# EAGLE design CMC_ECG (EAGLE 9.4.2)
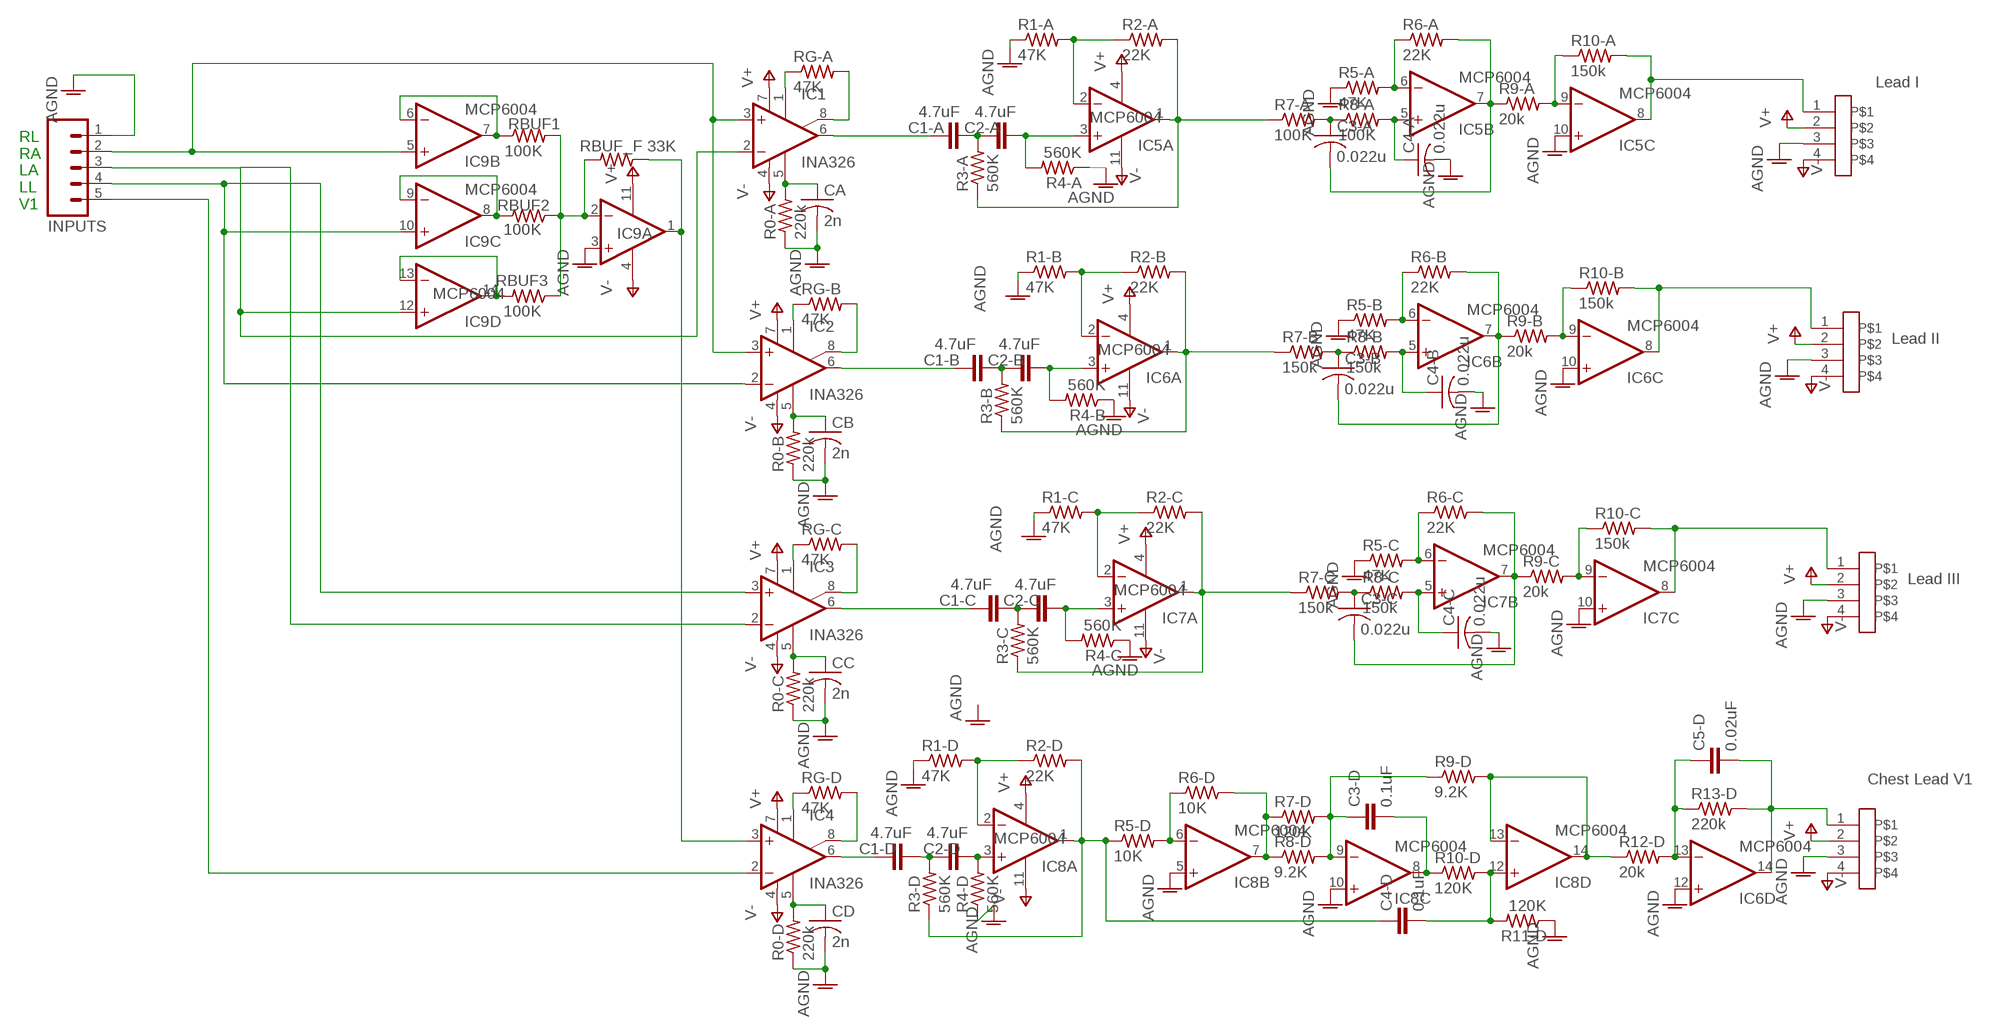
[diagram p0: schematic, sheet 1]

## Parts
C1-A  4.7uF  C-EUC0805  [C0805]
C1-B  4.7uF  C-EUC0805  [C0805]
C1-C  4.7uF  C-EUC0805  [C0805]
C1-D  4.7uF  C-EUC0805  [C0805]
C2-A  4.7uF  C-EUC0805  [C0805]
C2-B  4.7uF  C-EUC0805  [C0805]
C2-C  4.7uF  C-EUC0805  [C0805]
C2-D  4.7uF  C-EUC0805  [C0805]
C3-A  0.022u  C-USC0805  [C0805]
C3-B  0.022u  C-USC0805  [C0805]
C3-C  0.022u  C-USC0805  [C0805]
C3-D  0.1uF  C-EUC0805  [C0805]
C4-A  0.022u  C-USC0805  [C0805]
C4-B  0.022u  C-USC0805  [C0805]
C4-C  0.022u  C-USC0805  [C0805]
C4-D  0.1uF  C-EUC0805  [C0805]
C5-D  0.02uF  C-EUC0805  [C0805]
CA  2n  C-USC0805  [C0805]
CB  2n  C-USC0805  [C0805]
CC  2n  C-USC0805  [C0805]
CD  2n  C-USC0805  [C0805]
CHEST-V3  CON-4PIN_SIL  [CON-4PIN-SIL]
IC1  INA326  [MSOP-08]
IC2  INA326  [MSOP-08]
IC3  INA326  [MSOP-08]
IC4  INA326  [MSOP-08]
IC5  MCP6004  MCP604ST  [TSSOP14]
IC6  MCP6004  MCP604ST  [TSSOP14]
IC7  MCP6004  MCP604ST  [TSSOP14]
IC8  MCP6004  MCP604ST  [TSSOP14]
IC9  MCP6004  MCP604ST  [TSSOP14]
INPUTS  M05  [05P]
LEAD-I  CON-4PIN_SIL  [CON-4PIN-SIL]
LEAD-II  CON-4PIN_SIL  [CON-4PIN-SIL]
LEAD-II1  CON-4PIN_SIL  [CON-4PIN-SIL]
R0-A  220k  R-US_R0805  [R0805]
R0-B  220k  R-US_R0805  [R0805]
R0-C  220k  R-US_R0805  [R0805]
R0-D  220k  R-US_R0805  [R0805]
R1-A  47K  R-US_R0805  [R0805]
R1-B  47K  R-US_R0805  [R0805]
R1-C  47K  R-US_R0805  [R0805]
R1-D  47K  R-US_R0805  [R0805]
R2-A  22K  R-US_R0805  [R0805]
R2-B  22K  R-US_R0805  [R0805]
R2-C  22K  R-US_R0805  [R0805]
R2-D  22K  R-US_R0805  [R0805]
R3-A  560K  R-US_R0805  [R0805]
R3-B  560K  R-US_R0805  [R0805]
R3-C  560K  R-US_R0805  [R0805]
R3-D  560K  R-US_R0805  [R0805]
R4-A  560K  R-US_R0805  [R0805]
R4-B  560K  R-US_R0805  [R0805]
R4-C  560K  R-US_R0805  [R0805]
R4-D  560K  R-US_R0805  [R0805]
R5-A  47K  R-US_R0805  [R0805]
R5-B  47K  R-US_R0805  [R0805]
R5-C  47K  R-US_R0805  [R0805]
R5-D  10K  R-US_R0805  [R0805]
R6-A  22K  R-US_R0805  [R0805]
R6-B  22K  R-US_R0805  [R0805]
R6-C  22K  R-US_R0805  [R0805]
R6-D  10K  R-US_R0805  [R0805]
R7-A  100K  R-US_R0805  [R0805]
R7-B  150k  R-US_R0805  [R0805]
R7-C  150k  R-US_R0805  [R0805]
R7-D  120K  R-US_R0805  [R0805]
R8-A  100K  R-US_R0805  [R0805]
R8-B  150k  R-US_R0805  [R0805]
R8-C  150k  R-US_R0805  [R0805]
R8-D  9.2K  R-US_R0805  [R0805]
R9-A  20k  R-US_R0805  [R0805]
R9-B  20k  R-US_R0805  [R0805]
R9-C  20k  R-US_R0805  [R0805]
R9-D  9.2K  R-US_R0805  [R0805]
R10-A  150k  R-US_R0805  [R0805]
R10-B  150k  R-US_R0805  [R0805]
R10-C  150k  R-US_R0805  [R0805]
R10-D  120K  R-US_R0805  [R0805]
R11-D  120K  R-US_R0805  [R0805]
R12-D  20k  R-US_R0805  [R0805]
R13-D  220k  R-US_R0805  [R0805]
RBUF1  100K  R-US_R0805  [R0805]
RBUF2  100K  R-US_R0805  [R0805]
RBUF3  100K  R-US_R0805  [R0805]
RBUF_F  33K  R-US_R0805  [R0805]
RG-A  47K  R-US_R0805  [R0805]
RG-B  47K  R-US_R0805  [R0805]
RG-C  47K  R-US_R0805  [R0805]
RG-D  47K  R-US_R0805  [R0805]

## Nets
AGND: C4-A.2 C4-B.2 C4-C.2 CA.2 CB.2 CC.2 CD.2 CHEST-V3.3 IC5.10(C:+IN) IC6.10(C:+IN) IC6.12(D:+IN) IC7.10(C:+IN) IC8.5(B:+IN) IC8.10(C:+IN) IC9.3(A:+IN) INPUTS.1 LEAD-I.3 LEAD-II1.3 LEAD-II.3 R0-A.1 R0-B.1 R0-C.1 R0-D.1 R1-A.1 R1-B.1 R1-C.1 R1-D.1 R4-A.1 R4-B.1 R4-C.1 R4-D.1 R5-A.1 R5-B.1 R5-C.1 R11-D.1
HPF-OUT: IC5.1(A:OUT) R2-A.2 R3-A.1 R7-A.1
HPF-OUT1: IC6.1(A:OUT) R2-B.2 R3-B.1 R7-B.1
HPF-OUT2: IC7.1(A:OUT) R2-C.2 R3-C.1 R7-C.1
HPF-OUT3: C4-D.1 IC8.1(A:OUT) R2-D.2 R3-D.1 R5-D.1
INA-OUT: C1-A.1 IC1.6(OUT)
INA-OUT1: C1-B.1 IC2.6(OUT)
INA-OUT2: C1-C.1 IC3.6(OUT)
N$1: IC1.8(R1B) RG-A.2
N$2: CA.1 IC1.5(R2) R0-A.2
N$3: C4-A.1 IC5.5(B:+IN) R8-A.2
N$4: IC1.1(R1) RG-A.1
N$5: C3-A.1 R7-A.2 R8-A.1
N$6: C3-A.2 IC5.7(B:OUT) R6-A.2 R9-A.1
N$7: CD.1 IC4.5(R2) R0-D.2
N$8: CB.1 IC2.5(R2) R0-B.2
N$9: IC5.6(B:-IN) R5-A.2 R6-A.1
N$10: IC2.1(R1) RG-B.1
N$11: C1-A.2 C2-A.1 R3-A.2
N$12: C2-A.2 IC5.3(A:+IN) R4-A.2
N$13: IC5.2(A:-IN) R1-A.2 R2-A.1
N$14: C1-B.2 C2-B.1 R3-B.2
N$15: C2-B.2 IC6.3(A:+IN) R4-B.2
N$16: IC6.2(A:-IN) R1-B.2 R2-B.1
N$17: IC2.8(R1B) RG-B.2
N$18: C3-B.1 R7-B.2 R8-B.1
N$19: C3-B.2 IC6.7(B:OUT) R6-B.2 R9-B.1
N$20: IC6.6(B:-IN) R5-B.2 R6-B.1
N$21: C4-B.1 IC6.5(B:+IN) R8-B.2
N$22: IC1.2(-IN) IC3.2(-IN) IC9.12(D:+IN) INPUTS.3
N$23: CC.1 IC3.5(R2) R0-C.2
N$24: IC3.1(R1) RG-C.1
N$25: C1-C.2 C2-C.1 R3-C.2
N$26: C2-C.2 IC7.3(A:+IN) R4-C.2
N$27: IC7.2(A:-IN) R1-C.2 R2-C.1
N$28: IC3.8(R1B) RG-C.2
N$29: C3-C.1 R7-C.2 R8-C.1
N$30: C3-C.2 IC7.7(B:OUT) R6-C.2 R9-C.1
N$31: IC7.6(B:-IN) R5-C.2 R6-C.1
N$32: C4-C.1 IC7.5(B:+IN) R8-C.2
N$33: IC4.2(-IN) INPUTS.5
N$34: IC7.9(C:-IN) R9-C.2 R10-C.1
N$35: C1-D.2 C2-D.1 R3-D.2
N$36: IC7.8(C:OUT) LEAD-II1.1 R10-C.2
N$37: IC9.6(B:-IN) IC9.7(B:OUT) RBUF1.1
N$38: IC9.8(C:OUT) IC9.9(C:-IN) RBUF2.2
N$39: IC9.13(D:-IN) IC9.14(D:OUT) RBUF3.2
N$40: IC9.2(A:-IN) RBUF1.2 RBUF2.1 RBUF3.1 RBUF_F.2
N$41: C2-D.2 IC8.3(A:+IN) R4-D.2
N$42: IC2.2(-IN) IC3.3(+IN) IC9.10(C:+IN) INPUTS.4
N$43: IC4.1(R1) RG-D.1
N$44: IC4.8(R1B) RG-D.2
N$46: IC8.2(A:-IN) R1-D.2 R2-D.1
N$47: IC8.6(B:-IN) R5-D.2 R6-D.1
N$48: C1-D.1 IC4.6(OUT)
N$49: IC8.7(B:OUT) R6-D.2 R7-D.1 R8-D.1
N$50: C3-D.1 IC8.9(C:-IN) R7-D.2 R8-D.2 R9-D.1
N$51: C3-D.2 IC8.8(C:OUT) R10-D.1
N$52: C4-D.2 IC8.12(D:+IN) R10-D.2 R11-D.2
N$53: IC8.13(D:-IN) IC8.14(D:OUT) R9-D.2 R12-D.1
N$55: IC5.9(C:-IN) R9-A.2 R10-A.1
N$56: IC6.9(C:-IN) R9-B.2 R10-B.1
N$58: C5-D.1 IC6.13(D:-IN) R12-D.2 R13-D.1
N$59: C5-D.2 CHEST-V3.1 IC6.14(D:OUT) R13-D.2
N$61: IC6.8(C:OUT) LEAD-II.1 R10-B.2
N$62: IC5.8(C:OUT) LEAD-I.1 R10-A.2
V+: CHEST-V3.2 IC1.7(+VS) IC2.7(+VS) IC3.7(+VS) IC4.7(+VS) IC5.4(P:V+) IC6.4(P:V+) IC7.4(P:V+) IC8.4(P:V+) IC9.11(P:V-) LEAD-I.2 LEAD-II1.2 LEAD-II.2
V-: CHEST-V3.4 IC1.4(-VS) IC2.4(-VS) IC3.4(-VS) IC4.4(-VS) IC5.11(P:V-) IC6.11(P:V-) IC7.11(P:V-) IC8.11(P:V-) IC9.4(P:V+) LEAD-I.4 LEAD-II1.4 LEAD-II.4
VIN+: IC1.3(+IN) IC2.3(+IN) IC9.5(B:+IN) INPUTS.2
VIN+1: IC4.3(+IN) IC9.1(A:OUT) RBUF_F.1
Unconnected: IC5.12(D:+IN) IC5.13(D:-IN) IC5.14(D:OUT) IC7.12(D:+IN) IC7.13(D:-IN) IC7.14(D:OUT)

## Notes on the sheet
- Lead I
- RL
  RA
  LA
  LL
  V1
- Lead II
- Lead III
- Chest Lead V1

## Library data of the parts
C1-A C1-B C1-C C1-D C2-A C2-B C2-C C2-D C3-D C4-D C5-D = rcl:C-EU: CAPACITOR, European symbol
C3-A C3-B C3-C C4-A C4-B C4-C CA CB CC CD = rcl:C-US: CAPACITOR, American symbol
CHEST-V3 LEAD-I LEAD-II LEAD-II1 = surdev:CON-4PIN_SIL
IC1-IC4 = burr-brown_updated:INA326
IC5-IC9 = linear:MCP604: Quad Op Amp 2.7V to 6.0V Single Supply CMOS Source: http://ww1.microchip.com/downloads/en/DeviceDoc/21314g.pdf
INPUTS = con-amp-quick:M05: AMP QUICK CONNECTOR; OC_FARNELL: unknown; OC_NEWARK: unknown
R0-A R0-B R0-C R0-D R1-A R1-B R1-C R1-D R2-A R2-B R2-C R2-D R3-A R3-B R3-C R3-D R4-A R4-B R4-C R4-D R5-A R5-B R5-C R5-D R6-A R6-B R6-C R6-D R7-A R7-B R7-C R7-D R8-A R8-B R8-C R8-D R9-A R9-B R9-C R9-D R10-A R10-B R10-C R10-D R11-D R12-D R13-D RBUF1-RBUF3 RBUF_F RG-A RG-B RG-C RG-D = rcl:R-US_: RESISTOR, American symbol

## Board
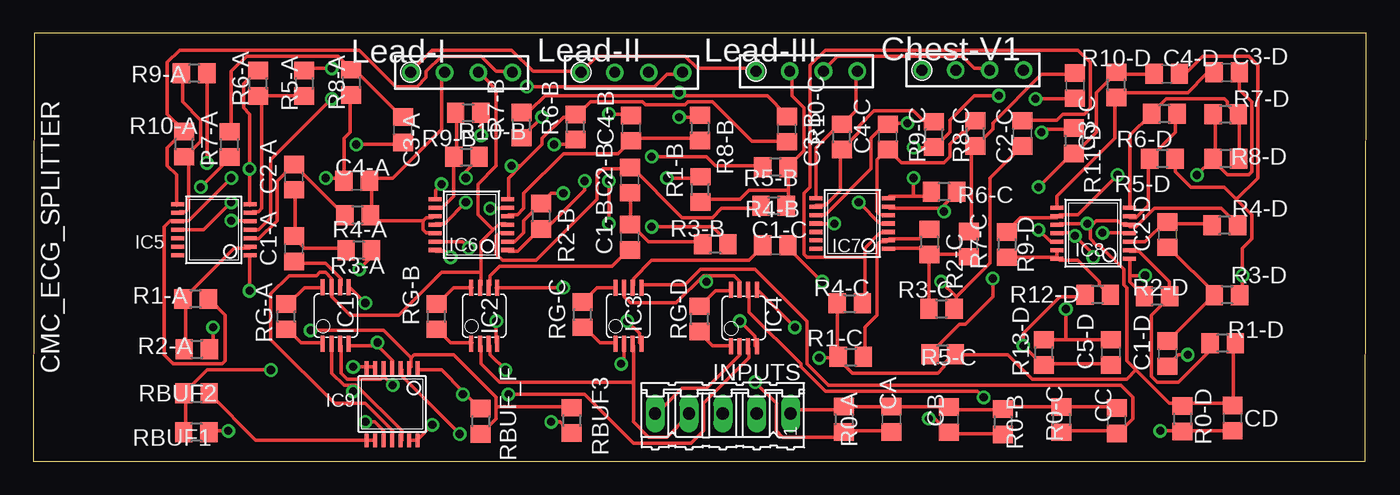
[diagram p1: board, top side]
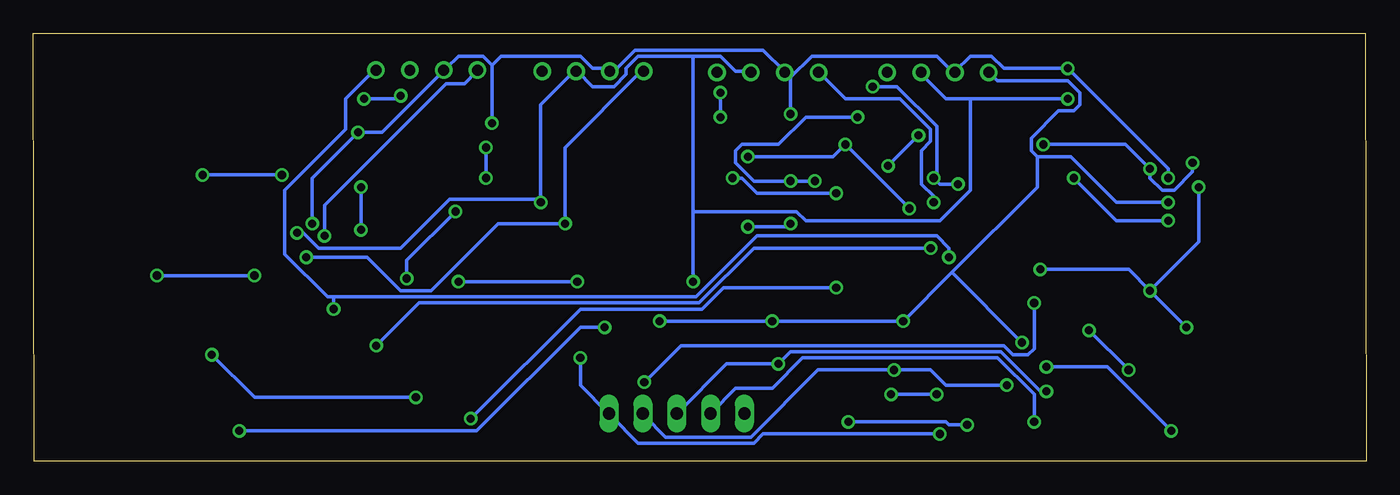
[diagram p2: board, bottom side, seen from below]

Size 100.03 x 32.12 mm. Coordinates in mm from the lower left corner, seen from the top.
Outline: 0,0 99.95,0 100.03,32.12 0.08,32.12 0,0
Copper layers (1*16): Top 0.035mm / dielectric 1.5mm / Bottom 0.035mm
Design rules "default": minimum track width 10mil, minimum drill 24mil, track to track 8mil, track to pad 8mil, pad to pad 8mil, via to via 8mil, smd to smd 8mil, copper to edge 40mil, drill to drill 8mil, minimum pad ring 10mil, minimum via ring 8mil, stop-mask expansion 4mil, vias tented up to drill 0mil, thermal gap 10mil

### Footprints (pad centres in the part's own frame; a part is rotated, then mirrored left to right if it is on the bottom)
C0805 = smd 1.3 x 1.5: 1 -0.95,0; 2 0.95,0
CON-4PIN-SIL = drill 0.813: 1 5.08,0; 2 2.54,0; 3 0,0; 4 -2.54,0
MSOP-08 = smd 0.3 x 1.2: 1 -0.976,-2.113; 2 -0.326,-2.113; 3 0.324,-2.113; 4 0.974,-2.113; 5 0.974,2.112; 6 0.324,2.112; 7 -0.326,2.112; 8 -0.976,2.112
TSSOP14 = smd 0.305 x 0.991: 1 -1.905,-2.718; 2 -1.27,-2.718; 3 -0.635,-2.718; 4 0,-2.718; 5 0.635,-2.718; 6 1.27,-2.718; 7 1.905,-2.718; 8 1.905,2.718; 9 1.27,2.718; 10 0.635,2.718; 11 0,2.718; 12 -0.635,2.718; 13 -1.27,2.718; 14 -1.905,2.718
05P = drill 0.914 long: 1 -5.08,0; 2 -2.54,0; 3 0,0; 4 2.54,0; 5 5.08,0
R0805 = smd 1.3 x 1.5: 1 -0.95,0; 2 0.95,0

### Placement (x,y rotation side)
C1-A  19.56,15.95 90 top
C1-B  44.77,16.81 90 top
C1-C  55.68,16.21 0 top
C1-D  85.12,8.08 90 top
C2-A  19.56,21.33 90 top
C2-B  44.77,21.1 90 top
C2-C  74.23,24.6 90 top
C2-D  85.12,17.02 90 top
C3-A  27.74,24.88 270 top
C3-B  56.56,24.93 270 top
C3-C  78.18,28.2 270 top
C3-D  89.56,29.18 180 top
C4-A  24.26,21.05 0 top
C4-B  44.87,25.01 90 top
C4-C  64.12,24.35 90 top
C4-D  85.06,29.07 180 top
C5-D  80.87,8.18 90 top
CA  64.4,3.16 90 top
CB  68.72,3.14 90 top
CC  81.31,3.05 90 top
CD  90.01,3.25 90 top
CHEST-V3  69.24,29.35 0 top
IC1  22.7,10.94 0 top
IC2  33.85,10.93 0 top
IC3  44.66,10.92 0 top
IC4  53.33,10.76 0 top
IC5  13.55,17.37 90 top
IC6  32.88,17.76 90 top
IC7  61.46,17.85 90 top
IC8  79.54,17.12 90 top
IC9  26.94,4.29 180 top
INPUTS  51.75,3.6 180 top
LEAD-I  30.86,29.18 0 top
LEAD-II  43.64,29.19 0 top
LEAD-II1  56.77,29.27 0 top
R0-A  60.83,3.16 270 top
R0-B  72.77,2.97 270 top
R0-C  77.16,3.13 270 top
R0-D  86.24,3.19 270 top
R1-A  12.19,12.18 180 top
R1-B  50.06,20.4 90 top
R1-C  61.36,7.83 0 top
R1-D  89.26,8.86 180 top
R2-A  12.28,8.42 0 top
R2-B  38.1,18.39 270 top
R2-C  67.25,16.47 270 top
R2-D  84.34,12.37 180 top
R3-A  24.42,15.84 180 top
R3-B  51.19,16.29 180 top
R3-C  68.17,11.47 0 top
R3-D  89.58,12.48 180 top
R4-A  24.34,18.48 180 top
R4-B  55.57,19.16 180 top
R4-C  61.28,11.85 0 top
R4-D  89.42,17.71 180 top
R5-A  20.33,28.37 270 top
R5-B  55.7,22.08 180 top
R5-C  68.25,8.03 180 top
R5-D  84.74,22.71 180 top
R6-A  16.89,28.37 90 top
R6-B  40.7,25.09 90 top
R6-C  68.36,20.22 180 top
R6-D  84.89,26.07 180 top
R7-A  14.72,23.78 90 top
R7-B  36.63,25.24 90 top
R7-C  70.21,16.3 90 top
R7-D  89.48,26.03 180 top
R8-A  23.87,28.43 270 top
R8-B  50.03,25.01 270 top
R8-C  70.71,24.6 90 top
R8-D  89.5,22.71 180 top
R9-A  12.07,29.11 180 top
R9-B  32.64,26.14 180 top
R9-C  67.6,24.53 90 top
R9-D  73.08,16.26 270 top
R10-A  11.34,23.8 90 top
R10-B  32.5,22.84 0 top
R10-C  60.67,24.35 90 top
R10-D  81.28,28.24 90 top
R11-D  78.09,24.05 270 top
R12-D  79.89,12.51 180 top
R13-D  75.85,8.18 90 top
RBUF1  12.23,2.18 180 top
RBUF2  12.25,5.11 0 top
RBUF3  40.41,3.08 270 top
RBUF_F  33.58,3.01 270 top
RG-A  18.98,10.87 90 top
RG-B  30.26,10.86 90 top
RG-C  41.23,11.01 90 top
RG-D  50.01,10.69 90 top

### Tracks (layer width: path | path; a pad name or v marks a point on that pad's centre or on a via)
AGND  (via drill 0.61)
  Top 0.254: R4-C.1 60.35,11.66 60.35,8 R1-C.1 60.35,7.77 | 60.35,7.77 61.49,6.63 67.89,6.63 68.35,7.09 68.35,7.32 69.04,8 R5-C.1 69.27,8 73.15,8 74.98,6.17 82.07,6.17 82.75,6.86 | R1-D.1 90.07,8.69 90.07,4.34 CD.2 89.84,4.34 86.41,4.34 R0-D.1 86.18,4.34 85.27,4.34 82.75,6.86 | 79.32,17.83 79.55,17.83 79.78,18.06 81.38,18.06 81.61,17.83 82.07,17.83 IC8.5 82.3,17.6 82.75,17.6 84.12,18.97 89.15,18.97 90.3,17.83 R4-D.1 | 79.32,17.83 v79.1,17.83 77.04,17.83 IC8.10 | 82.75,6.86 82.07,7.54 82.07,13.03 81.84,13.26 81.84,14.4 80.01,16.23 79.78,16.23 79.32,16.69 79.32,17.83 | CC.2 81.15,4.12 77.27,4.12 R0-C.1 77.04,4.12 72.92,4.12 R0-B.1 72.69,3.89 68.81,3.89 CB.2 68.58,4.12 64.47,4.12 CA.2 64.24,4.12 61.04,4.12 R0-A.1 60.81,3.89 57.15,3.89 56.92,3.66 INPUTS.1 | v32,2.06 27.66,6.4 27.66,6.86 IC9.3 | v58.98,7.77 60.35,7.77 | 56.69,20.34 56.69,21.95 R5-B.1 56.69,22.17 57.84,23.32 57.84,26.52 56.92,27.43 56.92,29.26 LEAD-II1.3 | 56.69,20.34 56.69,19.2 R4-B.1 | 56.69,20.34 53.72,20.34 53.03,19.66 50.06,19.66 R1-B.1 | IC7.10 58.75,18.52 59.44,18.52 62.87,21.95 62.87,24.23 64.01,25.38 C4-C.2 64.24,25.38 v65.61,25.38 | v75.67,24.69 75.89,24.92 77.95,24.92 R11-D.1 | R1-A.1 13.26,12.12 14.4,10.97 14.4,7.54 14.17,7.32 10.52,7.32 9.83,8 9.83,17.6 10.29,18.06 10.74,18.06 IC5.10 10.97,18.06 11.66,18.06 v14.86,21.26 | 29.26,18.06 29.26,17.37 29.49,17.14 29.95,17.14 IC6.12 | 29.26,18.06 29.49,18.29 29.95,18.29 IC6.10 | 29.26,18.06 25.6,18.06 25.38,18.29 R4-A.1 25.38,18.52 25.38,21.03 C4-A.2 25.38,21.26 26.98,21.26 30.63,24.92 30.63,28.8 30.86,29.03 LEAD-I.3 | v43.2,26.06 44.81,26.06 C4-B.2
  Top 0.254: v22.4,29.49 20.34,29.49 R5-A.1
  Bottom 0.254: v32,2.06 45.26,2.06 45.95,1.37 54.63,1.37 56.69,3.43 INPUTS.1 56.92,3.66 58.98,5.71 v58.98,7.77 | 65.61,29.72 v65.61,25.38 | 65.61,29.72 66.29,30.4 68.12,30.4 69.04,29.49 CHEST-V3.3 69.27,29.26 73.84,24.69 v75.67,24.69 79.1,21.26 v79.1,17.83 | 65.61,29.72 64.92,30.4 58.98,30.4 58.06,29.49 56.92,29.49 LEAD-II1.3 56.69,29.49 56.24,29.49 54.86,30.86 45.26,30.86 43.66,29.26 LEAD-II.3 | 43.2,28.8 v43.2,26.06 | 43.2,28.8 43.43,29.03 LEAD-II.3 | 43.2,28.8 41.6,30.4 32.23,30.4 31.09,29.26 LEAD-I.3 30.86,29.26 29.72,30.4 28.12,30.4 27.2,29.49 v22.4,29.49 14.86,21.95 v14.86,21.26 | 43.2,28.8 LEAD-II.3
HPF-OUT  (via drill 0.61)
  Top 0.254: v16.23,12.8 16.23,15.32 IC5.1 | v13.49,10.06 13.49,8.69 13.26,8.46 R2-A.2 | v12.57,20.57 14.63,22.63 R7-A.1 | v24.46,14.4 25.15,15.09 25.15,15.77 R3-A.1
  Bottom 0.254: v13.49,10.06 v16.23,12.8 | v12.57,20.57 12.57,16.46 v16.23,12.8 | v24.46,14.4 17.83,14.4 v16.23,12.8
HPF-OUT1  (via drill 0.61)
  Top 0.254: IC6.1 35.66,15.77 36.35,15.77 37.95,17.37 R2-B.2 38.18,17.6 38.63,17.6 41.38,20.34 v41.38,21.03 | v38.18,25.83 36.8,24.46 R7-B.1 | v46.41,17.6 50.98,17.6 52.12,16.46 R3-B.1 | v43.2,21.03 v43.2,17.83
  Bottom 0.254: v38.18,25.83 42.06,25.83 44.12,23.77 46.86,23.77 47.32,23.32 47.32,22.4 45.95,21.03 v43.2,21.03 v41.38,21.03 | v46.41,17.6 43.43,17.6 v43.2,17.83
HPF-OUT2
  Top 0.254: IC7.1 64.24,16 66.75,16 67.21,15.54 R2-C.2 | R3-C.1 67.21,11.66 67.21,15.32 R2-C.2 | R7-C.1 70.18,15.54 67.44,15.54 R2-C.2
HPF-OUT3  (via drill 0.61)
  Top 0.254: 82.3,13.95 82.3,13.49 83.21,12.57 R2-D.2 | 82.3,13.95 82.3,15.09 IC8.1 | 90.3,19.66 89.38,20.57 86.87,20.57 85.72,21.72 85.72,22.63 R5-D.1 | 90.3,19.66 91.44,18.52 91.44,16.69 90.75,16 v90.75,13.95 90.75,12.57 R3-D.1 | 90.3,19.66 91.9,21.26 91.9,29.72 91.21,30.4 87.78,30.4 86.64,29.26 86.18,29.26 C4-D.1 | v83.44,13.95 82.3,13.95
  Bottom 0.254: v90.75,13.95 v83.44,13.95
INA-OUT
  Top 0.254: IC1.6 23.09,13.26 23.09,13.72 21.95,14.86 19.66,14.86 C1-A.1
INA-OUT1
  Top 0.254: IC2.6 34.29,13.26 34.29,13.95 34.98,14.63 43.43,14.63 44.58,15.77 C1-B.1
INA-OUT2
  Top 0.254: IC3.6 45.03,13.26 45.03,13.72 46.41,15.09 53.72,15.09 54.63,16 C1-C.1
N$1
  Top 0.254: IC1.8 21.72,13.03 20.34,13.03 19.2,11.89 RG-A.2
N$2  (via drill 0.61)
  Top 0.254: v24.92,11.89 23.77,13.03 IC1.5 | v54.18,5.94 55.78,4.34 55.78,2.29 56.24,1.83 60.58,1.83 60.81,2.06 R0-A.2 61.04,2.29 64.24,2.29 CA.1
  Bottom 0.254: v24.92,11.89 24.92,8.46 25.38,8 26.52,8 27.2,8.69 51.44,8.69 v54.18,5.94
N$3  (via drill 0.61)
  Top 0.254: v14.86,18.06 16.23,18.06 IC5.5 | v21.95,21.26 23.09,21.26 C4-A.1 23.32,21.26 23.32,24.23 23.77,24.69 23.77,27.43 R8-A.2
  Bottom 0.254: v14.86,18.06 18.75,18.06 v21.95,21.26
N$4
  Top 0.254: IC1.1 21.72,8.91 20.12,8.91 19.2,9.83 RG-A.1
N$5
  Top 0.254: R7-A.2 14.86,24.92 14.86,29.26 16,30.4 22.86,30.4 23.77,29.49 R8-A.1 24,29.49 27.66,25.83 C3-A.1
N$6  (via drill 0.61)
  Top 0.254: IC5.7 16.23,19.2 v16.23,21.95 16.23,26.06 15.77,26.52 15.77,28.35 16.69,29.26 R6-A.2 | v24.23,23.77 27.66,23.77 C3-A.2 | v13.03,22.4 13.03,29.03 R9-A.1
  Bottom 0.254: v24.23,23.77 18.06,23.77 v16.23,21.95 16.23,21.26 15.32,20.34 14.4,20.34 13.03,21.72 v13.03,22.4
N$7  (via drill 0.61)
  Top 0.254: v57.15,10.06 54.41,12.8 IC4.5 | v84.58,2.29 86.18,2.29 R0-D.2 86.41,2.29 89.84,2.29 CD.1
  Bottom 0.254: v57.15,10.06 58.98,10.06 66.75,2.29 v84.58,2.29
N$8  (via drill 0.61)
  Top 0.254: v39.78,13.03 34.75,13.03 IC2.5 | v67.21,3.2 67.67,3.2 68.58,2.29 CB.1 68.81,2.06 72.69,2.06 R0-B.2
  Bottom 0.254: v39.78,13.03 48.23,13.03 49.84,11.43 58.98,11.43 v67.21,3.2
N$9
  Top 0.254: IC5.6 16.46,18.75 16.92,18.75 17.14,18.97 17.14,26.98 16.92,27.2 R6-A.1 16.92,27.43 20.12,27.43 R5-A.2
N$10
  Top 0.254: IC2.1 32.92,8.91 31.32,8.91 30.4,9.83 RG-B.1
N$11
  Top 0.254: C2-A.1 19.66,20.34 19.66,16.92 C1-A.2 19.66,16.69 20.34,16 23.32,16 R3-A.2
N$12
  Top 0.254: IC5.3 16.46,16.69 16.92,16.69 18.29,18.06 18.29,21.03 19.43,22.17 C2-A.2 19.66,22.17 23.32,18.52 R4-A.2
N$13
  Top 0.254: IC5.2 16.23,16 15.09,16 11.43,12.34 R1-A.2 11.43,12.12 11.43,8.46 R2-A.1
N$14
  Top 0.254: 44.81,17.83 44.81,20.12 C2-B.1 | 44.81,17.83 46.18,16.46 50.06,16.46 R3-B.2 | 44.81,17.83 C1-B.2
N$15
  Top 0.254: IC6.3 35.43,17.14 34.98,17.14 34.75,16.92 34.75,15.54 35.2,15.09 37.72,15.09 42.29,19.66 42.29,21.49 42.75,21.95 44.58,21.95 C2-B.2 44.81,22.17 48.69,18.29 50.98,18.29 51.66,18.97 54.41,18.97 R4-B.2
N$16  (via drill 0.61)
  Top 0.254: IC6.2 35.66,16.46 36.12,16.46 36.8,17.14 36.8,18.06 37.95,19.2 R2-B.1 38.18,19.43 38.86,20.12 v39.78,20.12 | v47.55,21.26 49.84,21.26 R1-B.2
  Bottom 0.254: v47.55,21.26 46.86,21.26 45.72,20.12 v39.78,20.12
N$17
  Top 0.254: IC2.8 32.92,13.03 31.55,13.03 30.4,11.89 RG-B.2
N$18  (via drill 0.61)
  Top 0.254: 48.46,27.43 55.09,27.43 56.46,26.06 C3-B.1 | 48.46,27.43 38.41,27.43 37.26,26.29 36.8,26.29 R7-B.2 | v48.46,25.83 49.84,25.83 R8-B.1 | 48.46,27.43 v48.46,27.66
  Bottom 0.254: v48.46,27.66 v48.46,25.83
N$19  (via drill 0.61)
  Top 0.254: 36.58,22.17 38.18,23.77 38.18,24.23 39.78,25.83 40.69,25.83 R6-B.2 40.92,26.06 41.83,26.98 45.72,26.98 45.95,26.75 48.92,26.75 49.15,26.98 50.98,26.98 53.95,24 56.46,24 C3-B.2 | 36.58,22.17 35.66,21.26 35.66,19.66 IC6.7 | v33.6,24.46 33.6,26.06 R9-B.1 | 36.58,22.17 v35.89,22.17
  Bottom 0.254: v35.89,22.17 v33.6,24.46
N$20  (via drill 0.61)
  Top 0.254: v34.29,18.97 35.43,18.97 IC6.6 | v39.09,23.77 40.46,23.77 40.69,24 R6-B.1 | v46.41,22.86 50.52,22.86 51.21,22.17 54.63,22.17 R5-B.2
  Bottom 0.254: v34.29,18.97 v39.09,23.77 40.01,22.86 v46.41,22.86
N$21
  Top 0.254: IC6.5 35.66,18.52 36.35,18.52 36.8,18.97 36.8,20.12 39.78,23.09 43.89,23.09 44.81,24 C4-B.1 45.03,24.23 49.84,24.23 R8-B.2
N$22  (via drill 0.61)
  Top 0.254: 24,5.71 23.32,5.71 22.4,6.63 22.4,8.69 IC1.2 | 24,5.71 24.23,5.71 27.66,2.29 27.66,1.6 IC9.12 | v44.12,7.32 44.35,7.54 44.35,8.69 IC3.2 | v24,5.26 24,5.71
  Bottom 0.254: INPUTS.3 51.66,3.66 48.01,7.32 v44.12,7.32 43.2,8.23 27.43,8.23 24.46,5.26 v24,5.26
N$23
  Top 0.254: IC3.5 45.72,13.26 48.92,13.26 50.06,14.4 54.18,14.4 58.06,10.52 58.06,7.32 59.66,5.71 81.61,5.71 82.53,4.8 82.53,3.2 81.38,2.06 CC.1 81.15,2.29 77.27,2.29 R0-C.2
N$24
  Top 0.254: IC3.1 43.66,8.91 42.52,8.91 41.38,10.06 RG-C.1
N$25  (via drill 0.61)
  Top 0.254: 69.27,12.34 69.27,11.66 R3-C.2 | 69.27,12.34 71.78,14.86 71.78,21.26 74.07,23.55 C2-C.1 | v59.21,13.49 56.69,16 C1-C.2 | 69.27,12.34 v68.12,13.49
  Bottom 0.254: v68.12,13.49 v59.21,13.49
N$26
  Top 0.254: 62.41,15.32 62.41,11.89 R4-C.2 | 62.41,15.32 62.41,16 63.55,17.14 64.01,17.14 IC7.3 | 62.41,15.32 58.06,15.32 57.84,15.54 57.84,20.12 58.29,20.57 58.29,29.72 59.44,30.86 78.41,30.86 79.32,29.95 79.32,26.52 78.87,26.06 77.27,26.06 76.81,25.6 74.3,25.6 C2-C.2
N$27
  Top 0.254: R2-C.1 67.21,17.37 66.52,16.69 64.24,16.69 IC7.2 64.01,16.46 63.55,16.46 63.32,16.23 63.32,10.97 62.41,10.06 62.41,8 R1-C.2
N$28
  Top 0.254: IC3.8 43.66,13.03 42.29,13.03 41.38,12.12 RG-C.2
N$29
  Top 0.254: R7-C.2 70.41,17.37 70.41,23.32 70.64,23.55 R8-C.1 70.87,23.77 72.01,24.92 72.01,25.38 75.67,29.03 77.95,29.03 C3-C.1
N$30  (via drill 0.61)
  Top 0.254: 66.06,19.89 66.98,19.89 67.21,20.12 R6-C.2 | 66.06,19.89 64.24,19.89 IC7.7 | v66.06,23.55 67.44,23.55 R9-C.1 67.67,23.55 68.81,24.69 68.81,25.6 70.64,27.43 v72.47,27.43 | 66.06,19.89 v66.06,21.26 | v75.21,27.2 77.95,27.2 C3-C.2
  Bottom 0.254: v66.06,21.26 v66.06,23.55 | v75.21,27.2 72.69,27.2 v72.47,27.43
N$31  (via drill 0.61)
  Top 0.254: 68.12,18.97 64.24,18.97 IC7.6 | 68.12,18.97 69.27,20.12 R6-C.1 | v72.01,13.72 72.01,12.34 69.95,10.29 69.49,10.29 67.44,8.23 R5-C.2 | 68.12,18.97 v68.35,18.75
  Bottom 0.254: v72.01,13.72 72.01,15.09 v68.35,18.75
N$32
  Top 0.254: IC7.5 64.01,18.52 63.55,18.52 63.32,18.75 63.32,22.63 64.01,23.32 C4-C.1 64.24,23.32 65.15,22.4 68.35,22.4 68.81,22.86 68.81,23.77 69.72,24.69 69.95,24.69 70.64,25.38 R8-C.2
N$33
  Top 0.254: IC4.2 53.03,8.46 53.03,8 50.52,5.49 48.69,5.49 46.86,3.66 INPUTS.5
N$34
  Top 0.254: IC7.9 58.75,19.2 59.44,19.2 60.58,20.34 60.58,23.32 R10-C.1 60.81,23.55 61.95,24.69 61.95,25.15 63.09,26.29 66.06,26.29 66.75,25.6 67.44,25.6 R9-C.2
N$35
  Top 0.254: C1-D.2 85.27,9.14 88.47,12.34 R3-D.2 88.7,12.57 85.27,16 C2-D.1
N$36
  Top 0.254: IC7.8 58.75,19.89 58.75,23.55 60.58,25.38 R10-C.2 60.81,25.38 61.72,26.29 61.72,29.26 LEAD-II1.1
N$37  (via drill 0.61)
  Top 0.254: IC9.6 25.6,7.09 25.15,7.09 IC9.7 24.92,7.09 v24,7.09 | v14.63,2.29 13.26,2.29 RBUF1.1
  Bottom 0.254: v24,7.09 19.43,7.09 v14.63,2.29
N$38
  Top 0.254: IC9.9 25.6,1.6 25.15,1.6 IC9.8 24.92,1.6 16.69,1.6 13.26,5.03 RBUF2.2
N$39  (via drill 0.61)
  Top 0.254: 28.8,1.6 28.35,1.6 IC9.13 | v29.95,2.74 28.8,1.6 | v38.86,2.97 39.55,2.97 40.23,2.29 RBUF3.2 | 28.8,1.6 IC9.14
  Bottom 0.254: v29.95,2.74 31.32,2.74 31.55,2.97 v38.86,2.97
N$40  (via drill 0.61)
  Top 0.254: RBUF1.2 11.43,2.29 11.43,5.03 RBUF2.1 11.43,5.26 13.03,6.86 v17.83,6.86 | 28.35,7.77 28.35,7.09 IC9.2 | 28.35,7.77 28.57,8 31.55,8 34.75,4.8 34.75,4.12 | 34.75,4.12 34.75,3.2 33.6,2.06 RBUF_F.2 | 34.75,4.12 40.23,4.12 RBUF3.1 | v20.8,9.83 26.29,9.83 28.35,7.77
  Bottom 0.254: v20.8,9.83 v17.83,6.86
N$41
  Top 0.254: IC8.3 82.3,16.46 83.44,16.46 85.04,18.06 C2-D.2 85.27,17.83 88.47,17.83 R4-D.2
N$42  (via drill 0.61)
  Top 0.254: v24.92,2.97 25.6,2.97 26.29,2.29 26.29,1.6 IC9.10 | 45.03,5.94 45.03,2.97 46.18,1.83 47.55,1.83 49.15,3.43 INPUTS.4 | 45.03,5.94 45.03,8.69 IC3.3 | 45.03,5.94 34.98,5.94 33.6,7.32 33.6,8.69 IC2.2
  Bottom 0.254: v24.92,2.97 24.92,5.03 27.66,7.77 42.29,7.77 44.58,5.49 47.32,5.49 49.15,3.66 INPUTS.4
N$43
  Top 0.254: IC4.1 52.35,8.69 50.98,8.69 50.06,9.6 RG-D.1
N$44
  Top 0.254: IC4.8 52.35,12.8 51.21,12.8 50.06,11.66 RG-D.2
N$46
  Top 0.254: IC8.2 82.3,15.77 82.98,15.77 85.27,13.49 85.27,12.57 R2-D.1 85.27,12.34 83.9,10.97 83.9,6.4 84.35,5.94 85.95,5.94 88.24,8.23 88.24,8.69 R1-D.2
N$47
  Top 0.254: IC8.6 82.3,18.29 82.75,18.29 83.67,19.2 83.67,22.63 R5-D.2 83.9,22.86 85.72,24.69 85.72,26.06 R6-D.1
N$48  (via drill 0.61)
  Top 0.254: v71.32,4.8 70.87,5.26 59.44,5.26 57.61,7.09 57.61,7.32 53.72,11.2 53.72,12.8 IC4.6 | v86.64,8 85.95,8 85.27,7.32 C1-D.1
  Bottom 0.254: v71.32,4.8 83.44,4.8 v86.64,8
N$49
  Top 0.254: R8-D.1 90.53,22.86 90.53,25.83 R7-D.1 90.3,26.06 89.61,26.75 89.61,26.98 89.38,27.2 85.04,27.2 84.12,26.29 R6-D.2 83.9,26.06 82.3,24.46 82.3,18.97 IC8.7
N$50  (via drill 0.61)
  Top 0.254: R9-D.1 73.15,17.37 74.07,18.29 76.81,18.29 IC8.9 77.04,18.52 78.41,18.52 v81.38,21.49 | R7-D.2 88.7,25.83 88.7,22.86 R8-D.2 88.47,22.63 | 88.47,22.63 89.61,21.49 91.21,21.49 91.44,21.72 91.44,26.98 90.53,27.89 90.53,29.03 C3-D.1 | 88.47,22.63 v87.33,21.49
  Bottom 0.254: v87.33,21.49 v81.38,21.49
N$51
  Top 0.254: IC8.8 76.81,18.97 76.81,19.89 81.15,24.23 81.15,27.2 R10-D.1 81.38,27.43 81.61,27.66 86.64,27.66 88.01,29.03 88.47,29.03 C3-D.2
N$52  (via drill 0.61)
  Top 0.254: C4-D.2 83.9,29.03 81.38,29.03 R10-D.2 81.15,29.03 79.78,27.66 79.78,24.69 78.18,23.09 R11-D.2 77.95,23.09 v75.44,20.57 | v75.44,17.37 76.35,16.46 76.81,16.46 IC8.12
  Bottom 0.254: v75.44,20.57 v75.44,17.37
N$53
  Top 0.254: 76.81,15.32 76.81,15.77 IC8.13 | 76.81,15.32 73.15,15.32 R9-D.2 | 76.81,15.32 IC8.14 77.04,15.09 78.41,15.09 80.01,13.49 80.01,13.26 80.7,12.57 R12-D.1
N$55
  Top 0.254: IC5.9 10.97,18.75 11.43,18.75 11.66,18.97 11.66,22.4 11.43,22.63 R10-A.1 11.43,22.86 12.57,24 12.57,25.6 11.2,26.98 11.2,29.03 R9-A.2
N$56
  Top 0.254: IC6.9 30.18,18.97 30.63,18.97 31.55,19.89 31.55,22.63 R10-B.1 31.77,22.86 31.77,26.06 R9-B.2
N$58  (via drill 0.61)
  Top 0.254: v32.69,16 32.23,16.46 30.18,16.46 IC6.13 | R12-D.2 78.87,12.34 77.04,12.34 74.3,9.6 v74.3,8.69 75.67,7.32 R13-D.1 75.89,7.32 80.7,7.32 C5-D.1
  Bottom 0.254: v32.69,16 45.95,16 50.06,11.89 71.09,11.89 v74.3,8.69
N$59  (via drill 0.61)
  Top 0.254: 77.5,9.14 80.7,9.14 C5-D.2 | 77.5,9.14 75.89,9.14 R13-D.2 | v31.32,15.32 30.86,15.77 30.18,15.77 IC6.14 | v77.5,11.43 77.5,9.14
  Bottom 0.254: v31.32,15.32 31.32,16 32.23,16.92 45.72,16.92 50.29,12.34 77.5,12.34 | 77.5,12.34 77.95,12.34 81.15,15.54 81.15,20.34 76.58,24.92 76.58,27.2 74.52,29.26 CHEST-V3.1 | 77.5,12.34 v77.5,11.43
N$61  (via drill 0.61)
  Top 0.254: v30.63,20.8 30.18,20.34 30.18,19.66 IC6.8 | v32.46,21.26 32.46,21.72 33.38,22.63 R10-B.2 | v37.03,28.12 46.63,28.12 47.55,29.03 48.69,29.03 LEAD-II.1
  Bottom 0.254: v30.63,20.8 32,20.8 32.23,21.03 | v37.03,28.12 35.2,28.12 32.23,25.15 32.23,21.03 | 32.23,21.03 v32.46,21.26
N$62
  Top 0.254: IC5.8 10.74,19.2 10.74,21.49 10.06,22.17 10.06,23.55 11.2,24.69 R10-A.2 11.2,24.92 10.06,26.06 10.06,29.95 10.97,30.86 24.46,30.86 27.2,28.12 28.8,28.12 29.49,28.8 29.49,29.26 30.63,30.4 33.6,30.4 34.75,29.26 35.89,29.26 LEAD-I.1
V+  (via drill 0.61)
  Top 0.254: IC9.11 26.98,1.6 26.98,2.29 24.92,4.34 22.63,4.34 17.83,9.14 17.83,12.57 19.2,13.95 21.26,13.95 21.49,14.17 21.95,14.17 22.4,13.72 22.4,13.26 IC1.7 22.4,13.03 22.4,12.34 23.77,10.97 27.43,10.97 30.63,14.17 33.6,14.17 | 34.52,17.37 33.6,16.46 33.6,14.17 | 34.52,17.37 34.98,17.83 35.43,17.83 IC6.4 | 33.6,14.17 33.6,13.26 IC2.7 | v22.4,27.2 17.83,22.63 17.83,18.29 16.92,17.37 16.46,17.37 IC5.4 | 34.52,17.37 33.38,18.52 33.38,20.8 34.75,22.17 34.75,27.89 33.6,29.03 LEAD-I.2 | 50.52,13.95 52.58,13.95 53.03,13.49 53.03,13.03 IC4.7 | 50.52,13.95 50.29,13.95 48.23,11.89 44.81,11.89 44.35,12.34 44.35,13.03 IC3.7 | v61.95,19.43 63.55,17.83 64.01,17.83 IC7.4 | v80.24,17.14 82.07,17.14 IC8.4 | CHEST-V3.2 71.55,29.49 70.64,29.49 69.72,30.4 60.35,30.4 59.44,29.49 LEAD-II1.2 | v50.52,13.49 50.52,13.95
  Bottom 0.254: 29.72,27.2 31.55,27.2 33.38,29.03 LEAD-I.2 | 29.72,27.2 v22.4,27.2 | 61.95,19.66 61.95,26.75 59.44,29.26 LEAD-II1.2 59.21,29.26 58.06,28.12 56.46,28.12 55.55,29.03 55.55,29.49 54.63,30.4 50.52,30.4 | v80.24,17.14 79.78,17.14 78.64,16 72.47,16 68.81,19.66 61.95,19.66 | 61.95,19.66 v61.95,19.43 | 50.52,30.4 48.46,30.4 47.32,29.26 46.41,29.26 LEAD-II.2 | 50.52,30.4 50.52,18.75 | 50.52,18.75 v50.52,13.49 | 29.72,27.2 29.72,20.34 32,18.06 42.06,18.06 42.75,18.75 50.52,18.75
V-  (via drill 0.61)
  Top 0.254: IC8.11 77.04,17.14 77.95,17.14 v78.18,16.92 79.55,15.54 v79.55,15.32 | v60.12,17.83 58.75,17.83 IC7.11 | v32.46,19.43 30.86,17.83 30.18,17.83 IC6.11 | LEAD-II1.4 54.18,29.49 49.84,29.49 48.92,30.4 42.29,30.4 41.15,29.26 LEAD-II.4 40.92,29.26 37.49,29.26 35.89,30.86 29.95,30.86 28.35,29.26 LEAD-I.4 | 25.83,8.69 26.98,7.54 26.98,7.09 IC9.4 | 25.83,8.69 23.77,8.69 IC1.4 | v14.86,19.43 12.8,17.37 10.97,17.37 IC5.11 | v34.75,10.52 34.75,8.91 IC2.4 | v44.58,10.52 45.49,9.6 45.49,8.91 IC3.4 | v53.03,10.52 54.18,9.37 54.18,8.69 IC4.4 | v25.83,8.91 25.83,8.69
  Bottom 0.254: v78.18,16.92 78.18,19.2 69.04,28.35 67.67,28.35 66.75,29.26 CHEST-V3.4 | LEAD-II1.4 54.41,29.26 60.12,23.55 v60.12,17.83 65.15,17.83 70.18,12.8 72.47,12.8 74.98,15.32 v79.55,15.32 | v32.46,19.43 32.46,19.89 33.38,20.8 33.38,23.32 32.69,24 32.69,24.92 34.98,27.2 39.09,27.2 40.92,29.03 LEAD-II.4 | v14.86,19.43 18.75,19.43 22.17,22.86 24.69,22.86 | 24.69,22.86 25.15,23.32 25.15,24.23 23.09,26.29 21.95,26.29 21.49,26.75 21.49,27.66 22.4,28.57 27.66,28.57 28.12,29.03 LEAD-I.4 | 31.09,14.17 24.69,20.57 24.69,22.86 | 31.09,14.17 v34.75,10.52 v44.58,10.52 v53.03,10.52 | 31.09,14.17 v25.83,8.91
VIN+  (via drill 0.61)
  Top 0.254: 26.29,6.4 26.29,6.86 IC9.5 | 26.29,6.4 26.06,6.17 23.55,6.17 23.09,6.63 23.09,8.69 IC1.3 | v35.43,6.86 34.29,8 34.29,8.69 IC2.3 | v26.98,5.71 26.29,6.4
  Bottom 0.254: INPUTS.2 54.18,3.43 52.58,1.83 46.18,1.83 41.15,6.86 v35.43,6.86 32.69,6.86 31.55,5.71 v26.98,5.71
VIN+1  (via drill 0.61)
  Top 0.254: 32.23,5.26 33.38,4.12 RBUF_F.1 | 32.23,5.26 30.63,6.86 28.8,6.86 IC9.1 | v35.66,5.03 41.38,5.03 45.03,1.37 49.38,1.37 50.29,2.29 50.29,4.34 53.72,7.77 53.72,8.46 IC4.3 | 32.23,5.26 v32.23,5.03
  Bottom 0.254: v32.23,5.03 v35.66,5.03

### Text on the board
tNames: Lead-I | Lead-II | Lead-III | Chest-V1 | CMC_ECG_SPLITTER